# Altium schematic sheet norbi_lm_pl_dcr_power_ch.SchDoc: Имя
size 209 x 297 mm; ApprovedBy: Утвердил; CheckedBy: Проверил; Author: Разработал; Organization: НГУ; DocumentNumber: Децимальный номер Э3; SheetNumber: Лист; SheetTotal: Листов; PageSetup: Record=PageOptions|CenterHorizontal=True|CenterVertical=True|PrintScale=1.00|XCorrection=1.00|YCorrection=1.00|PrintKind=1|BorderSize=5000000|LeftOffset=0|BottomOffset=0|Orientation=2|PaperLength=1000|PaperWidth=1000|Scale=100|PaperSource=15|PrintQuality=1200|MediaType=1|DitherType=10|PaperKind=A3|PrintScaleMode=1; Weight: -; ScaleFactor: -; NormInspection: Норм.Контр.
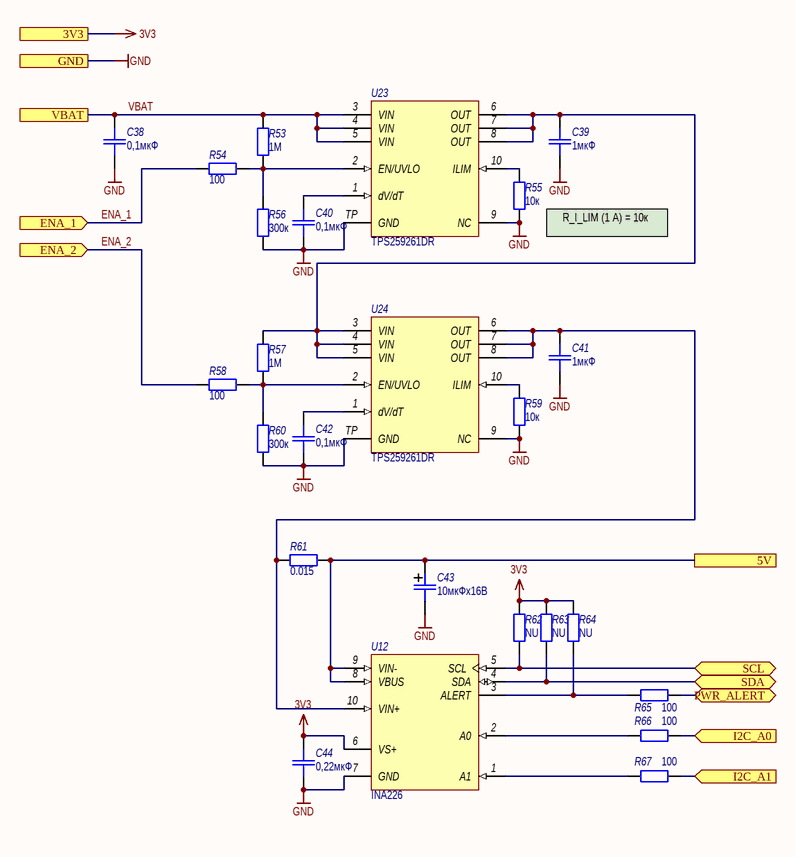
[diagram p0: norbi_lm_pl_dcr_power_ch.SchDoc]

## Parts
C38  0,1мкФ  [CR-0603]
C39  1мкФ  [CR-0603]
C40  0,1мкФ  [CR-0603]
C41  1мкФ  [CR-0603]
C42  0,1мкФ  [CR-0603]
C43  10мкФх16В  [C_SMD_SIZE_B]
C44  0,22мкФ  [CR-0603]
R53  1М  [CR-0603]
R54  100  [CR-0603]
R55  10к  [CR-0603]
R56  300к  [CR-0603]
R57  1М  [CR-0603]
R58  100  [CR-0603]
R59  10к  [CR-0603]
R60  300к  [CR-0603]
R61  0.015  [CR-1206]
R62  NU  [CR-0603]
R63  NU  [CR-0603]
R64  NU  [CR-0603]
R65  100  [CR-0603]
R66  100  [CR-0603]
R67  100  [CR-0603]
U12  INA261  [VSSOP-8]  (value not drawn)
U23  Наименование: TPS259261DR  [VSON-10]  (hidden comment: TPS259261ВК)
U24  Наименование: TPS259261DR  [VSON-10]  (hidden comment: TPS259261ВК)

## Ports
3V3, 5V, ENA_1 (in), ENA_2 (in), GND, I2C_A0 (in), I2C_A1 (in), PWR_ALERT (bidir), SCL (bidir), SDA (bidir), VBAT

## Nets
3V3: C44.2 R62.2 R63.2 R64.2 U12.6(VS+) ; port 3V3
GND: C38.1 C39.1 C40.1 C41.1 C42.1 C43.2 C44.1 R55.1 R56.1 R59.1 R60.1 U12.7(GND) U23.9(NC) U23.TP(GND) U24.9(NC) U24.TP(GND) ; port GND
5V: C43.1 R61.1 U12.8(VBUS) U12.9(VIN-) ; port 5V
ENA_1: R54.2 ; port ENA_1
ENA_2: R58.2 ; port ENA_2
I2C_A0: R66.1 ; port I2C_A0
I2C_A1: R67.1 ; port I2C_A1
PWR_ALERT: R65.1 ; port PWR_ALERT
SCL: R62.1 U12.5(SCL) ; port SCL
SDA: R63.1 U12.4(SDA) ; port SDA
VBAT: C38.2 R53.2 U23.3(VIN) U23.4(VIN) U23.5(VIN) ; port VBAT
NetC39_2: C39.2 R57.2 U23.6(OUT) U23.7(OUT) U23.8(OUT) U24.3(VIN) U24.4(VIN) U24.5(VIN)
NetC40_2: C40.2 U23.1(dV/dT)
NetC41_2: C41.2 R61.2 U12.10(VIN+) U24.6(OUT) U24.7(OUT) U24.8(OUT)
NetC42_2: C42.2 U24.1(dV/dT)
NetR53_1: R53.1 R54.1 R56.2 U23.2(EN/UVLO)
NetR55_2: R55.2 U23.10(ILIM)
NetR57_1: R57.1 R58.1 R60.2 U24.2(EN/UVLO)
NetR59_2: R59.2 U24.10(ILIM)
NetR64_1: R64.1 R65.2 U12.3(ALERT)
NetR66_2: R66.2 U12.2(A0)
NetR67_2: R67.2 U12.1(A1)

## Notes on the sheet
- (near R55) R_I_LIM (1 А) = 10к
- Подп. и дата
- Инв. № дубл.
- Взам. инв. №
- Инв. № подл.
- Изм.
- Лист
- № докум.
- Подп.
- Дата
- Форма 2а ГОСТ 2.104-2006
- Копировал
- Формат А4

## Library data of the parts
C38-C42 C44 = C_smd: Конденсатор для поверхностного монтажа; Назначение: Чип-конденсатор; Потребление, Вт: 0; Наименование: SMD-0603
  C38 C40 C42: Value: 0,1мкФ
  C39 C41: Value: 1мкФ
  C44: Value: 0,22мкФ
C43 = C_pol_smd: Поляризованный конеднсатор для поверхностного монтажа; Назначение: Поляризованный чип-конденсатор; Наименование: Конденсатор танталовый SMD; Потребление, Вт: 0; Value: 10мкФх16В
R53 R56 R57 R60 R62-R64 = R_smd: Резистор для поверхностного монтажа; Назначение: Чип-резистор; Наименование: SMD-0603 20%; Потребление, Вт: 0,001
  R53 R57: Value: 1М
  R56 R60: Value: 300к
  R62-R64: Value: NU
R54 R55 R58 R59 R65-R67 = R_smd: Резистор для поверхностного монтажа; Наименование: SMD-0603 20%; Назначение: Чип-резистор; Потребление, Вт: 0,001
  R54 R58 R65-R67: Value: 100
  R55 R59: Value: 10к
R61 = R_smd: Резистор для поверхностного монтажа; Назначение: Чип-резистор токоизмерительный; Наименование: PE1206DRM470R015L; Потребление, Вт: 0,001; Value: 0.015
U12 = INA226: High- or Low-Side Measurement, Bidirectional Current and Power Monitor With I2C Interface; Назначение: High-Side or Low-Side Measurement,; Потребление, Вт: 0,001; ComponentLink1Description: Data sheet; ComponentLink1URL: http://www.ti.com/lit/ds/symlink/ina226.pdf; Наименование: INA226
U23 U24 = TPS259261: Simple 5-V/12-V eFuse Protection Switches; Потребление, Вт: 0,001; Назначение: Simple 5-V/12-V eFuse Protection Switches; ComponentLink1Description: Datasheet; ComponentLink1URL: http://www.ti.com/lit/ds/symlink/tps25925.pdf